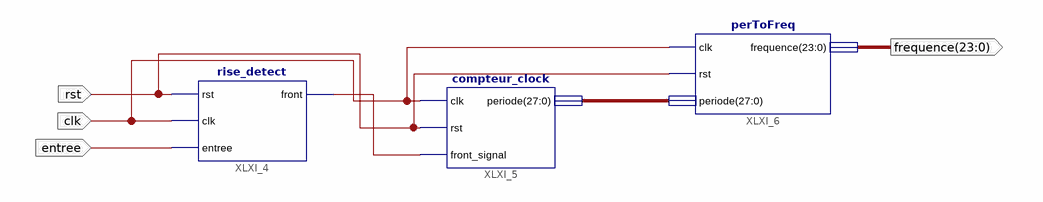
[diagram p0: schematic sheet 1]
// Xilinx ISE schematic echantillon.sch (spartan3e) as structural Verilog: 3 symbols, 4 ports
module echantillon (
  input  entree,
  input  clk,
  input  rst,
  output [23:0] frequence
);

  wire XLXN_2;
  wire [27:0] XLXN_6;

  rise_detect XLXI_4 (.rst(rst), .clk(clk), .entree(entree), .front(XLXN_2));
  compteur_clock XLXI_5 (.clk(clk), .rst(rst), .front_signal(XLXN_2), .periode(XLXN_6));
  perToFreq XLXI_6 (.clk(clk), .rst(rst), .periode(XLXN_6), .frequence(frequence));
endmodule
